# EasyEDA Pro project TO-56 Laser Simple 4 Pin Mount.eprj

# Schematic Schematic1
Board Name: Board1; Create Date: 2025-06-19; Page Name: P1; Project Name: TO-56 Laser Simple 4 Pin Mount; Schematic Name: Schematic1; Update Date: 2025-06-19; Company: EasyEDA.com; Page Size: A4; Version: V1.0
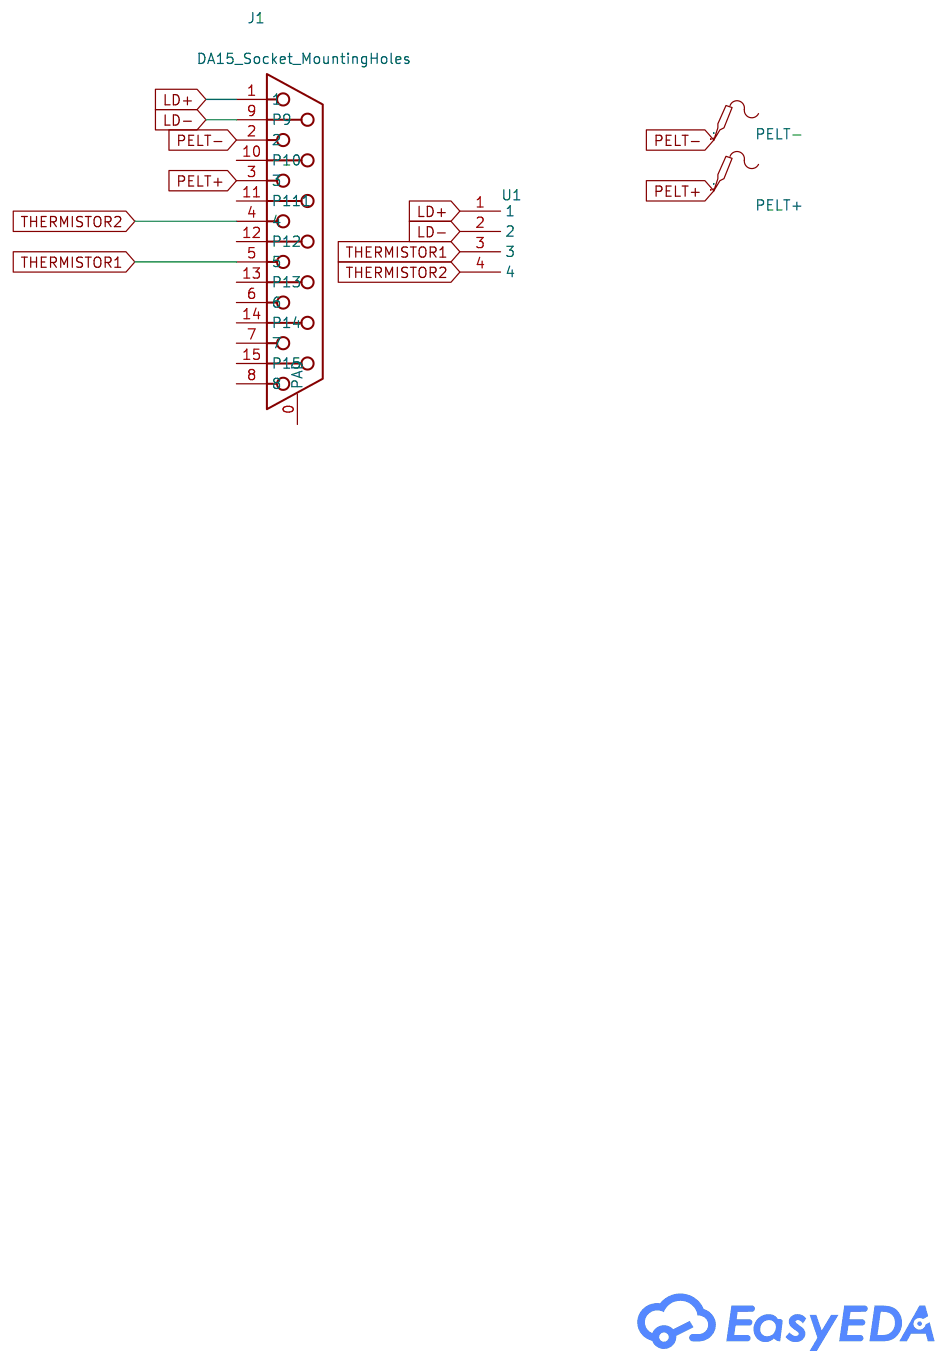
[diagram p0: schematic sheet]

## Parts
J1  DA15_Socket_MountingHoles  [Connector_Dsub:DSUB-15_Socket_Vertical_P2.77x2.84mm_MountingHoles]
PELT+  -  [Test-Point-0.5mm]
PELT-  -  [Test-Point-0.5mm]
U1  -  [TO56]

## Library data of the parts
J1 = Connector_DA15_Socket_MountingHoles: 15-pin D-SUB connector, socket (female) (low-density/2 columns), Mounting Hole; Users: REF**
PELT+ PELT- = Test-Point
U1 = TO56

## Nets
LD+: J1.1 U1.1
LD-: J1.9(P9) U1.2
PELT+: J1.3 PELT+.1
PELT-: J1.2 PELT-.1
THERMISTOR1: J1.5 U1.3
THERMISTOR2: J1.4 U1.4

Not connected (* = marked no-connect by the designer): J1 0(PAD) 6 7 8 10(P10) 11(P111) 12(P12) 13(P13) 14(P14) 15(P15)

# Board PCB1
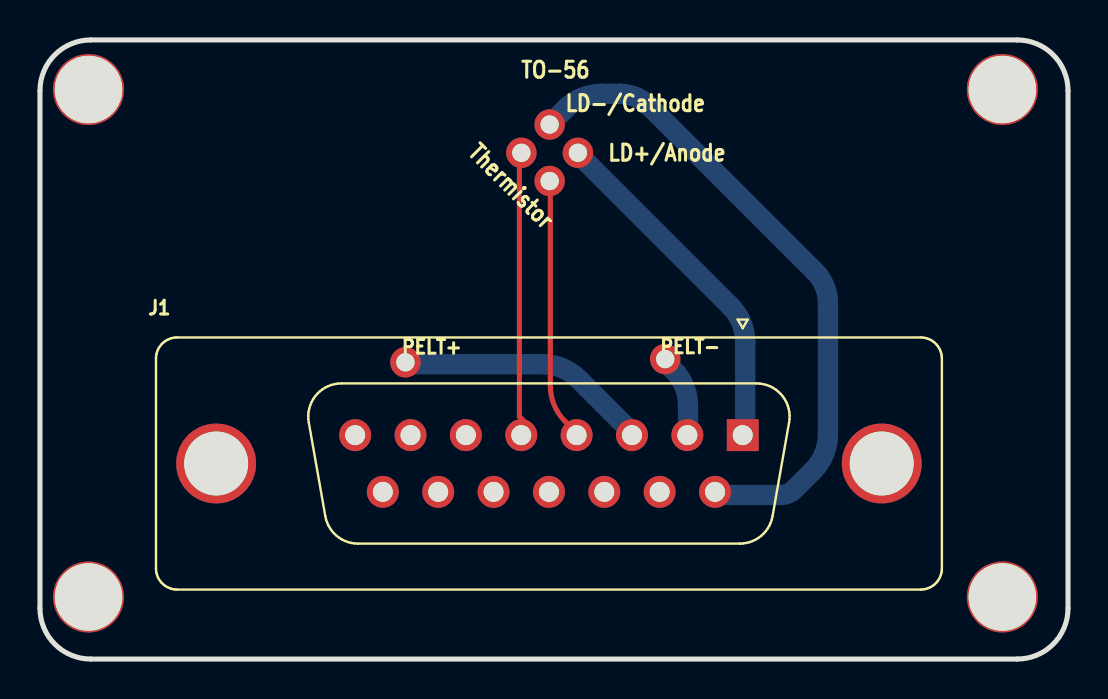
[diagram p1: board, top side]
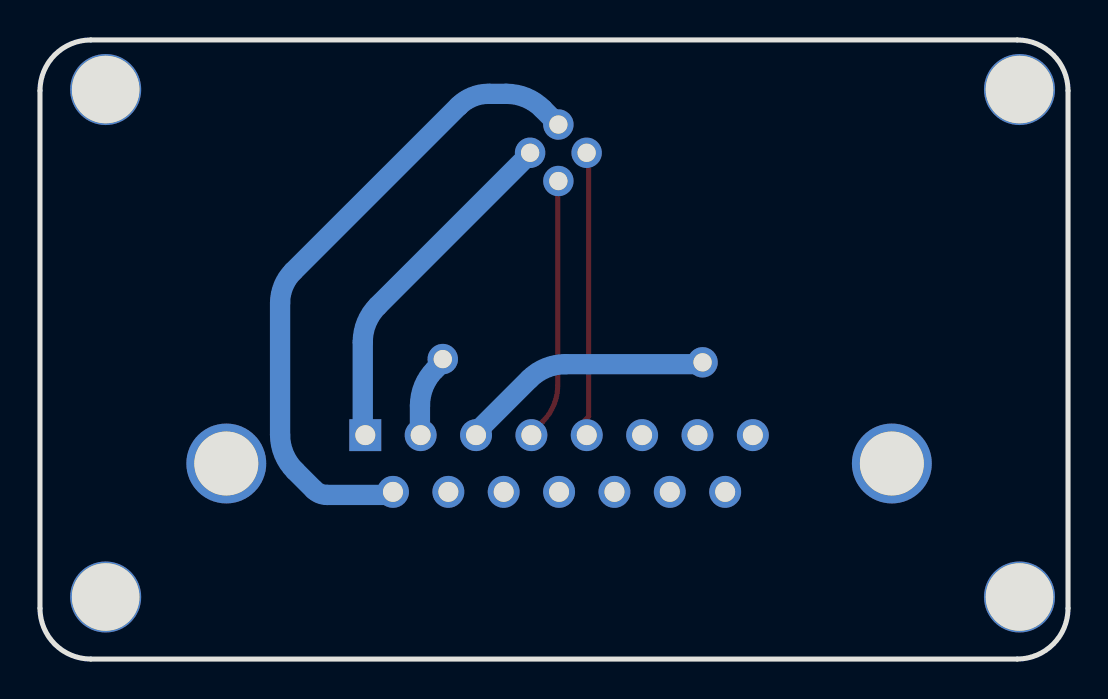
[diagram p2: board, bottom side, seen from below]

Outline 51.43 x 30.99 mm; copper layers: Top Layer, Bottom Layer. Coordinates in mm from the lower left corner of the outline.
Outline path: 0,28.45 0,2.54 arc(0.74,0.74) 2.54,0 48.89,0 arc(50.69,0.74) 51.43,2.54 51.43,28.45 arc(50.69,30.24) 48.89,30.99 2.54,30.99 arc(0.74,30.24) 0,28.45
Stack: Top Layer 0.035mm / Dielectric1 1.51mm FR4 er 4.5 / Bottom Layer 0.035mm

## Design rules (mm)
template: JLCPCB Capability(Two Layers Board)
spacing copperThickness1oz (default): track to track 0.102, other pairs 0.152 to 0.3
spacing copperThickness2oz: track to track 0.203, other pairs 0.152 to 0.3
track width copperThickness1oz (default): min 0.127, default 0.254, max 2.54
track width copperThickness2oz: min 0.203, default 0.254, max 2.54
differential pair differentialPair (default): width min 0.127, default 0.254, max 2.54; gap min 0.152, default 0.152
via viaSize (default): diameter min 0.5, default 0.61, max 10; hole min 0.3, default 0.305, max 6.3

## Placement (name value [footprint] x y rotation side)
J1  DA15_Socket_MountingHoles  [Connector_Dsub:DSUB-15_Socket_Vertical_P2.77x2.84mm_MountingHoles]  35.16 11.21 0 top
Laser Diode  -  [TO56]  25.48 25.39 135 top
NOREF  -  [Pad_e170]  31.28 15.01 0 top
NOREF#2  -  [Pad_e16]  2.43 3.11 0 top
NOREF#3  -  [Pad_e256]  2.43 28.51 0 top
NOREF#4  -  [Pad_e15]  48.15 28.51 0 top
NOREF#5  -  [Pad_e17]  48.15 3.11 0 top
NOREF#6  -  [Pad_e168]  18.29 14.85 0 top
PELT+  -  [Test-Point-0.5mm]  18.27 14.84 0 top
PELT-  -  [Test-Point-0.5mm]  31.2 14.86 0 top

## Footprints (pads in the part's own frame, mm; a bottom-side part is the same pattern mirrored in y, then rotated)
Connector_Dsub:DSUB-15_Socket_Vertical_P2.77x2.84mm_MountingHoles
  round 4 hole 3.2: 0(-26.345,-1.42) 0(6.955,-1.42)
  rect 1.6x1.6 hole 1: 1(0,0)
  round 1.6 hole 1: 2(-2.77,0) 3(-5.54,0) 4(-8.31,0) 5(-11.08,0) 6(-13.85,0) 7(-16.62,0) 8(-19.39,0) 9(-1.385,-2.84) 10(-4.155,-2.84) 11(-6.925,-2.84) 12(-9.695,-2.84) 13(-12.465,-2.84) 14(-15.235,-2.84) 15(-18.005,-2.84)
Pad_e15
  round 3.556 hole 3.378: 1(0,0)
Pad_e16
  round 3.556 hole 3.378: 16(0,0)
Pad_e17
  round 3.556 hole 3.378: 17(0,0)
Pad_e168
  round 1.524 hole 0.914: 1(0,0)
Pad_e170
  round 1.524 hole 0.914: 1(0,0)
Pad_e256
  round 3.556 hole 3.378: 1(0,0)
Test-Point-0.5mm
  round 0.5 smd: 1(0,0)
TO56
  round 1.524 hole 0.914: 1(-1.048,-0.984) 2(0.952,-0.984) 3(0.952,1.016) 4(-1.048,1.016)

## Nets
LD+: J1.1 Laser Diode.1
LD-: J1.9 Laser Diode.2
PELT+: J1.3 NOREF#6.1 PELT+.1
PELT-: J1.2 NOREF.1 PELT-.1
THERMISTOR1: J1.5 Laser Diode.3
THERMISTOR2: J1.4 Laser Diode.4

Pads without a net: J1 0 6 7 8 10 11 12 13 14 15; NOREF#2 16; NOREF#3 1; NOREF#4 1; NOREF#5 17

## Routing (per net, layer and track width the routed paths; a pad name or vN(x,y) marks a point on that pad's centre or on a via; arc(x,y) is an arc through that point)
LD+: length 17.3
  Bottom Layer w1.016: 35.29,11.36 35.29,15.87 arc(35.09,16.84) 34.54,17.67 26.92,25.29
LD-: length 33
  Top Layer w0.254: 34.43,8.37 34.17,8.37
  Bottom Layer w1.016: 34.08,8.21 37.07,8.21 arc(37.43,8.28) 37.73,8.49 38.68,9.43 arc(39.23,10.26) 39.42,11.23 39.42,17.82 arc(39.25,18.67) 38.77,19.4 30.49,27.67 arc(29.81,28.13) 29,28.29 28.09,28.29 arc(27.12,28.1) 26.29,27.55 25.51,26.76
PELT+: length 12.8
  Bottom Layer w1.016: 18.27,14.76 25.15,14.76 arc(26.12,14.56) 26.95,14.01 29.7,11.27
PELT-: length 3.7
  Bottom Layer w1.016: 31.26,14.9 31.68,14.48 arc(32.23,13.66) 32.42,12.69 32.42,11.56
THERMISTOR1: length 13.9
  Top Layer w0.254: 24.59,11.54 23.99,12.14 23.99,25.18
THERMISTOR2: length 12.9
  Top Layer w0.254: 26.79,11.38 26.28,11.89 arc(25.73,12.72) 25.53,13.69 25.53,23.82

## Text on the board
Top Silkscreen Layer: TO-56 | LD-/Cathode | LD+/Anode | Thermistor
